# Altium schematic sheet Encoder.SchDoc
size A; SheetNumber: 1; SheetTotal: 1
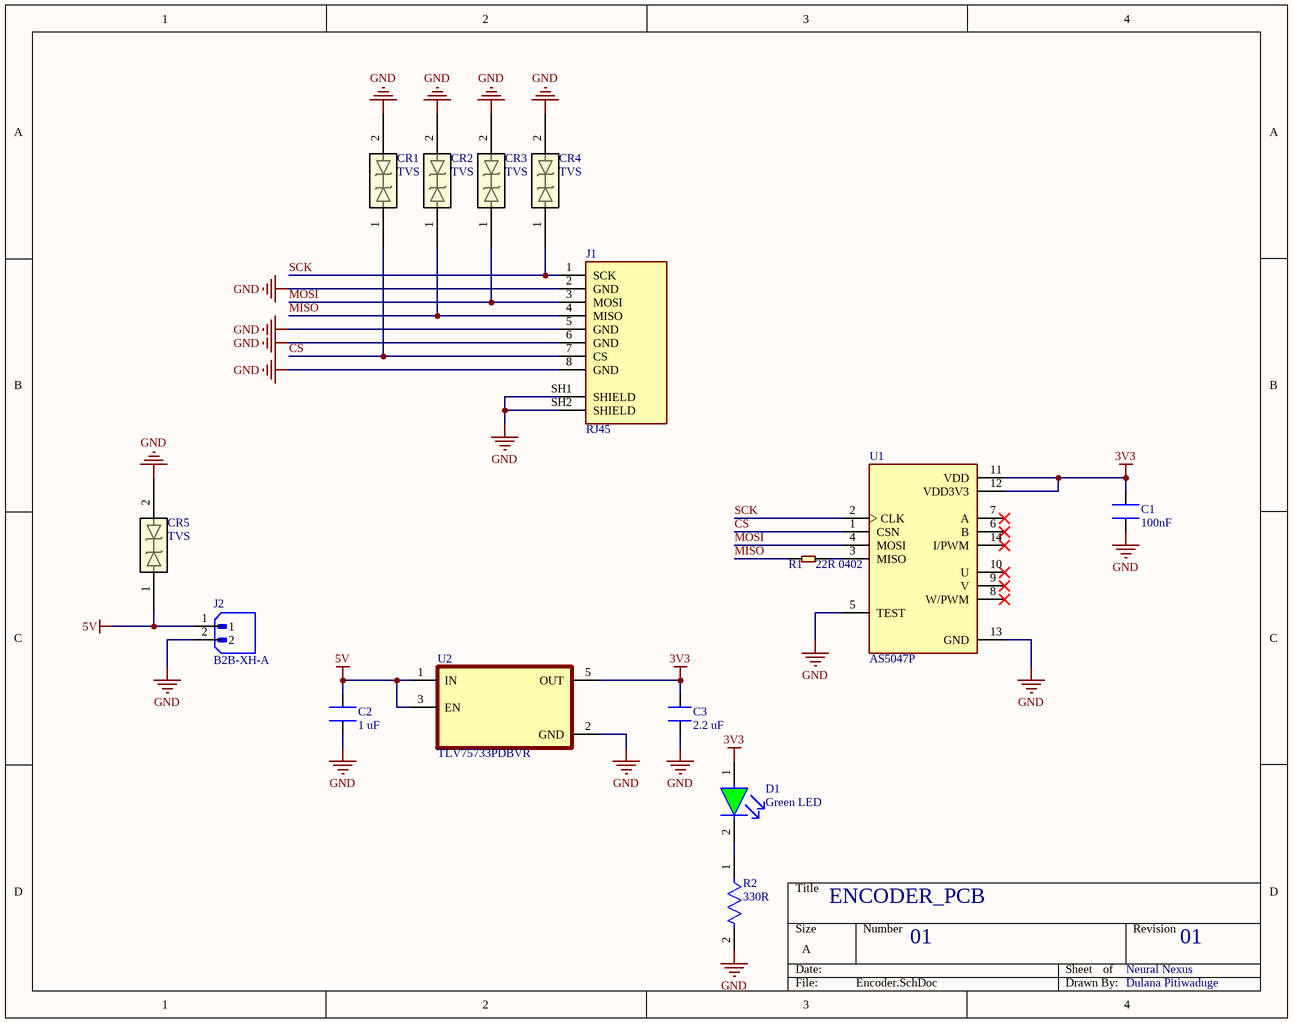
[diagram p0: Encoder.SchDoc]

## Parts
C1  100nF  [FP-C0805C-DN-IPC_A]
C2  1 uF  [CAPC2012X135N]
C3  2.2 uF  [CAPC2012X135N]
CR1  TVS  [SP0402_LTF]
CR2  TVS  [SP0402_LTF]
CR3  TVS  [SP0402_LTF]
CR4  TVS  [SP0402_LTF]
CR5  TVS  [SP0402_LTF]
D1  Green LED  [FP-SML-LX0805SRC-TR-MFG]
J1  RJ45  [AMPHENOL_RJHSE5380]
J2  B2B-XH-A  [JST_B2B-XH-A]
R1  22R 0402  [R0402]
R2  330R  [FP-RMCF0805-IPC_A]
U1  AS5047P  [SOP65P640X120-14N]
U2  TLV75733PDBVR  [SOT95P280X145-5N]

## Nets
3V3: C1.1 C3.2 D1.1(A) U1.11(VDD) U1.12(VDD3V3) U2.5(OUT)
5V: C2.1 CR5.1 J2.1 U2.1(IN) U2.3(EN)
GND: C1.2 C2.2 C3.1 CR1.2 CR2.2 CR3.2 CR4.2 CR5.2 J1.2(GND) J1.5(GND) J1.6(GND) J1.8(GND) J1.SH1(SHIELD) J1.SH2(SHIELD) J2.2 R2.2 U1.5(TEST) U1.13(GND) U2.2(GND)
CS: CR1.1 J1.7(CS) U1.1(CSN)
MISO: CR2.1 J1.4(MISO) R1.1
MOSI: CR3.1 J1.3(MOSI) U1.4(MOSI)
SCK: CR4.1 J1.1(SCK) U1.2(CLK)
NetD1_2: D1.2(C) R2.1
NetR1_2: R1.2 U1.3(MISO)

Not connected (* = marked no-connect by the designer): U1 6(B)* 7(A)* 8(W/PWM)* 9(V)* 10(U)* 14(I/PWM)*

## Notes on the sheet
- ENCODER_PCB
- 01
- Neural Nexus
- Dulana Pitiwaduge

## Library data of the parts
C1 = C0805C104K4RACTU: Multilayer Ceramic Capacitors MLCC - SMD/SMT 16V 0.1uF X7R 0805 10%; Manufacturer: Yageo Group; Manufacturer Package Identifier: 0805 (2012 metric); Temperature Coefficient: 30ppm/°C; Supplier: DigiKey; Supplier Part Number: 399-C0805C104K4RACTUCT-ND; Manufacturer Part Number: C0805C104K4RACTU; RoHS: Compliant; Category: Ceramic Capacitors; Stock: 138662; Pricing: 1=0.16, 10=0.092, 50=0.0648, 100=0.0564, 500=0.04244, 1000=0.03815 (USD); Value: 100nF; Case/Package: 0805; Case Code (Imperial): 0805; China RoHS: Compliant; Contact Plating: Tin; Country of Origin: Mexico; Depth: 1.25mm; Dielectric: X7R; Dielectric Material: Ceramic; Export Control Classification Number (ECCN) Code: EAR99; Height: 780µm; Harmonized Tariff Schedule (HTS) Code: 8532.24.00.20; Introduction Date: 2008-01-10; Lead Free: Lead Free; Lead Pitch: 750µm; Length: 2mm; Lifecycle Status: Production; Material: Ceramic; Max Operating Temperature: 125°C; Min Operating Temperature: -55°C; Mounting Technology: Surface Mount; Pins: 2; Number of Terminals: 2; Packaging: Cut Tape; Radiation Hardening: No; REACH SVHC: Yes; Schedule B: 8532240020, 8532240020|8532240020, 8532240020|8532240020|8532240020, 8532240020|8532240020|8532240020|8532240020; Termination: SMD/SMT; Thickness: 889µm; Tolerance: 10%; Voltage: 16V; Voltage Rating: 16V; Voltage Rating (DC): 16V; Width: 1.25mm; ComponentLink1URL: https://datasheet.octopart.com:443/C0805C104K4RACTU-KEMET-datasheet-178445679.pdf?src-supplier=IHS; ComponentLink1Description: https://datasheet.octopart.com:443/C0805C104K4RACTU-KEMET-datasheet-178445679.pdf?src-supplier=IHS; ComponentLink2URL: https://datasheet.octopart.com:443/C0805C104K4RACTU-KEMET-datasheet-182041125.pdf?src-supplier=IHS; ComponentLink2Description: https://datasheet.octopart.com:443/C0805C104K4RACTU-KEMET-datasheet-182041125.pdf?src-supplier=IHS; ComponentLink3URL: https://datasheet.octopart.com:443/C0805C104K4RACTU-KEMET-datasheet-137357759.pdf?src-supplier=Farnell; ComponentLink3Description: https://datasheet.octopart.com:443/C0805C104K4RACTU-KEMET-datasheet-137357759.pdf?src-supplier=Farnell; ComponentLink4URL: https://datasheet.octopart.com:443/C0805C104K4RACTU-KEMET-datasheet-99356104.pdf?src-supplier=Farnell; ComponentLink4Description: https://datasheet.octopart.com:443/C0805C104K4RACTU-KEMET-datasheet-99356104.pdf?src-supplier=Farnell; ComponentLink5URL: https://datasheet.octopart.com:443/C0805C104K4RACTU-Kemet-datasheet-32036385.pdf?src-supplier=Farnell; ComponentLink5Description: https://datasheet.octopart.com:443/C0805C104K4RACTU-Kemet-datasheet-32036385.pdf?src-supplier=Farnell; ComponentLink6URL: https://datasheet.octopart.com:443/C0805C104K4RACTU-Kemet-datasheet-27203261.pdf?src-supplier=Farnell; ComponentLink6Description: https://datasheet.octopart.com:443/C0805C104K4RACTU-Kemet-datasheet-27203261.pdf?src-supplier=Farnell; ComponentLink7URL: https://datasheet.octopart.com:443/C0805C104K4RACTU-KEMET-datasheet-68331921.pdf?src-supplier=Upverter; ComponentLink7Description: https://datasheet.octopart.com:443/C0805C104K4RACTU-KEMET-datasheet-68331921.pdf?src-supplier=Upverter; ComponentLink8URL: https://datasheet.octopart.com:443/C0805C104K4RACTU-Kemet-datasheet-66076749.pdf?src-supplier=element14+APAC; ComponentLink8Description: https://datasheet.octopart.com:443/C0805C104K4RACTU-Kemet-datasheet-66076749.pdf?src-supplier=element14+APAC; ComponentLink9URL: https://datasheet.octopart.com:443/C0805C104K4RACTU-Kemet-datasheet-66552730.pdf?src-supplier=element14+APAC; ComponentLink9Description: https://datasheet.octopart.com:443/C0805C104K4RACTU-Kemet-datasheet-66552730.pdf?src-supplier=element14+APAC; ComponentLink10URL: https://datasheet.octopart.com:443/C0805C104K4RACTU-KEMET-datasheet-37550250.pdf?src-supplier=Electro+Sonic; ComponentLink10Description: https://datasheet.octopart.com:443/C0805C104K4RACTU-KEMET-datasheet-37550250.pdf?src-supplier=Electro+Sonic; ComponentLink11URL: https://datasheet.octopart.com:443/C0805C104K4RACTU-KEMET-datasheet-164512540.pdf?src-supplier=TME; ComponentLink11Description: https://datasheet.octopart.com:443/C0805C104K4RACTU-KEMET-datasheet-164512540.pdf?src-supplier=TME; ComponentLink12URL: https://datasheet.octopart.com:443/C0805C104K4RACTU-KEMET-datasheet-103094571.pdf?src-supplier=TME; ComponentLink12Description: https://datasheet.octopart.com:443/C0805C104K4RACTU-KEMET-datasheet-103094571.pdf?src-supplier=TME; ComponentLink13URL: https://datasheet.octopart.com:443/C0805C104K4RACTU-KEMET-datasheet-68331906.pdf?src-supplier=TME; ComponentLink13Description: https://datasheet.octopart.com:443/C0805C104K4RACTU-KEMET-datasheet-68331906.pdf?src-supplier=TME; ComponentLink14URL: https://datasheet.octopart.com:443/C0805C104K4RACTU-KEMET-datasheet-110724412.pdf?src-supplier=RS+(Formerly+Allied+Electronics); ComponentLink14Description: https://datasheet.octopart.com:443/C0805C104K4RACTU-KEMET-datasheet-110724412.pdf?src-supplier=RS+(Formerly+Allied+Electronics); ComponentLink15URL: https://datasheet.octopart.com:443/C0805C104K4RACTU-Kemet-datasheet-464.pdf?src-supplier=RS+(Formerly+Allied+Electronics); ComponentLink15Description: https://datasheet.octopart.com:443/C0805C104K4RACTU-Kemet-datasheet-464.pdf?src-supplier=RS+(Formerly+Allied+Electronics); ComponentLink16URL: https://datasheet.octopart.com/C0805C104K4RACTU-KEMET-datasheet-84169754.pdf; ComponentLink16Description: https://datasheet.octopart.com/C0805C104K4RACTU-KEMET-datasheet-84169754.pdf; ComponentLink17URL: https://datasheet.octopart.com:443/C0805C104K4RACTU-Kemet-datasheet-21527579.pdf?src-supplier=Newark; ComponentLink17Description: https://datasheet.octopart.com:443/C0805C104K4RACTU-Kemet-datasheet-21527579.pdf?src-supplier=Newark; ComponentLink18URL: https://datasheet.octopart.com:443/C0805C104K4RACTU-Kemet-datasheet-17019117.pdf?src-supplier=Newark; ComponentLink18Description: https://datasheet.octopart.com:443/C0805C104K4RACTU-Kemet-datasheet-17019117.pdf?src-supplier=Newark; ComponentLink19URL: https://datasheet.octopart.com:443/C0805C104K4RACTU-Kemet-datasheet-11795462.pdf?src-supplier=Arrow+Electronics; ComponentLink19Description: https://datasheet.octopart.com:443/C0805C104K4RACTU-Kemet-datasheet-11795462.pdf?src-supplier=Arrow+Electronics; ComponentLink20URL: https://datasheet.octopart.com:443/C0805C104K4RACTU-Kemet-datasheet-5313890.pdf?src-supplier=Verical; ComponentLink20Description: https://datasheet.octopart.com:443/C0805C104K4RACTU-Kemet-datasheet-5313890.pdf?src-supplier=Verical; ComponentLink21URL: https://datasheet.octopart.com:443/C0805C104K4RAC-TU-Kemet-datasheet-8203742.pdf?src-supplier=Jameco; ComponentLink21Description: https://datasheet.octopart.com:443/C0805C104K4RAC-TU-Kemet-datasheet-8203742.pdf?src-supplier=Jameco; ComponentLink22URL: http://sigma.octopart.com:80/conflict_mineral_statement/Yageo-company-3.pdf?src-supplier=Compliance+Statements; ComponentLink22Description: http://sigma.octopart.com:80/conflict_mineral_statement/Yageo-company-3.pdf?src-supplier=Compliance+Statements; ComponentLink23URL: http://sigma.octopart.com:80/rohs_statement/Yageo-company-2.pdf?src-supplier=Compliance+Statements; ComponentLink23Description: http://sigma.octopart.com:80/rohs_statement/Yageo-company-2.pdf?src-supplier=Compliance+Statements
C2 = CL21B105KAFNNNE: 1 ÂµF Â±10% 25V Ceramic Capacitor X7R 0805 (2012 Metric); MF: Samsung Electro-Mechanics; SnapEDA_Link: https://www.snapeda.com/parts/CL21B105KAFNNNE/Samsung/view-part/?ref=snap; Package: SMD-2 Samsung; Value: *; MP: CL21B105KAFNNNE; Check_prices: https://www.snapeda.com/parts/CL21B105KAFNNNE/Samsung/view-part/?ref=eda
C3 = CL21B225KAFNNNE: 2.2 ÂµF Â±10% 25V Ceramic Capacitor X7R 0805 (2012 Metric); MF: Samsung; SnapEDA_Link: https://www.snapeda.com/parts/CL21B225KAFNNNE/Samsung/view-part/?ref=snap; Package: SMD-2 Samsung; Value: *; MP: CL21B225KAFNNNE; Check_prices: https://www.snapeda.com/parts/CL21B225KAFNNNE/Samsung/view-part/?ref=eda
CR1-CR5 = SP0402B-ULC-01ETG: TVS DIODE 7VWM 10VC DFN1006-2L; Manufacturer_Name: Littelfuse Inc; Copyright: Copyright (C) 2025 Ultra Librarian. All rights reserved.; Manufacturer_Part_Number: SP0402B-ULC-01ETG; RefDes: RefDes; Type: Type; LCSC Part Number: *
D1 = RED GREEN: LED RED CLEAR SMD; TRONIC part No: LE0011; LCSC Part Number: *
J1 = RJHSE5380: CONN MOD JACK 8P8C R/A SHIELDED; MF: Amphenol; Package: None; Price: None; Value: *; MP: RJHSE5380; Availability: Unavailable; LCSC Part Number: *
J2 = B2B-XH-A: MF: {'manufacturer': u'JST Sales America Inc.'}; Package: None; Price: None; Value: *; MP: B2B-XH-A; Availability: Unavailable
R1 = SMD-RES-22R-1%-1/16W(0402): 22 Ohms Â±1% 0.063W, 1/16W Chip Resistor 0402 (1005 Metric) Moisture Resistant Thick Film; MF: Yageo; MP: RC0402FR-0722RL; SnapEDA_Link: https://www.snapeda.com/parts/RC0402FR-0722RL/Yageo/view-part/?ref=snap; Package: 0402 Yageo; Value: *; Check_prices: https://www.snapeda.com/parts/RC0402FR-0722RL/Yageo/view-part/?ref=eda; LCSC Part Number: *
R2 = CMP-26527-004125-1: 330Ω ±5% 0.125W 0805 Thick Film Chip Resistor AEC-Q200 compliant; Power Rating: 125mW; Temperature Coefficient: 200ppm/°C; RoHS Compliant: Yes; Case Code (Imperial): 0805; Features: Automotive AEC-Q200; Mount: Surface Mount; Length: 2mm; Case Code (Metric): 2012; Series: RMCF; Construction: Rectangular; Radiation Hardening: No; Tolerance: 5%; Depth: 1.25mm; Military Standard: Not; Resistor Type: Thick Film; Min Operating Temperature: -55°C; Lead Free: Lead Free; Max Operating Temperature: 155°C; Number of Terminations: 2; Contact Plating: Tin; Width: 0.049inch; Height: 0.026inch; Resistance: 330R; Size Code: 0805; Case/Package: 0805; Max Power Dissipation: 125mW; Packaging: Tape and Reel
U1 = AS5047P-ATSM: Rotary Encoder Magnetic Programmable PWM -; MF: ams; SnapEDA_Link: https://www.snapeda.com/parts/AS5047P-ATSM/ams/view-part/?ref=snap; Package: TSSOP-14 ams; Value: *; MP: AS5047P-ATSM; Check_prices: https://www.snapeda.com/parts/AS5047P-ATSM/ams/view-part/?ref=eda
U2 = TLV75733PDBVR: 1-A, low-IQ high-accuracy low-dropout (LDO) voltage regulator with enable; MF: Texas Instruments; SnapEDA_Link: https://www.snapeda.com/parts/TLV75733PDBVR/Texas+Instruments/view-part/?ref=snap; Package: SOT-23-5 Texas Instruments; Value: *; MP: TLV75733PDBVR; Check_prices: https://www.snapeda.com/parts/TLV75733PDBVR/Texas+Instruments/view-part/?ref=eda